# Altium schematic sheet MainSheet.SchDoc
size A4; SheetNumber: 1; SheetTotal: 7
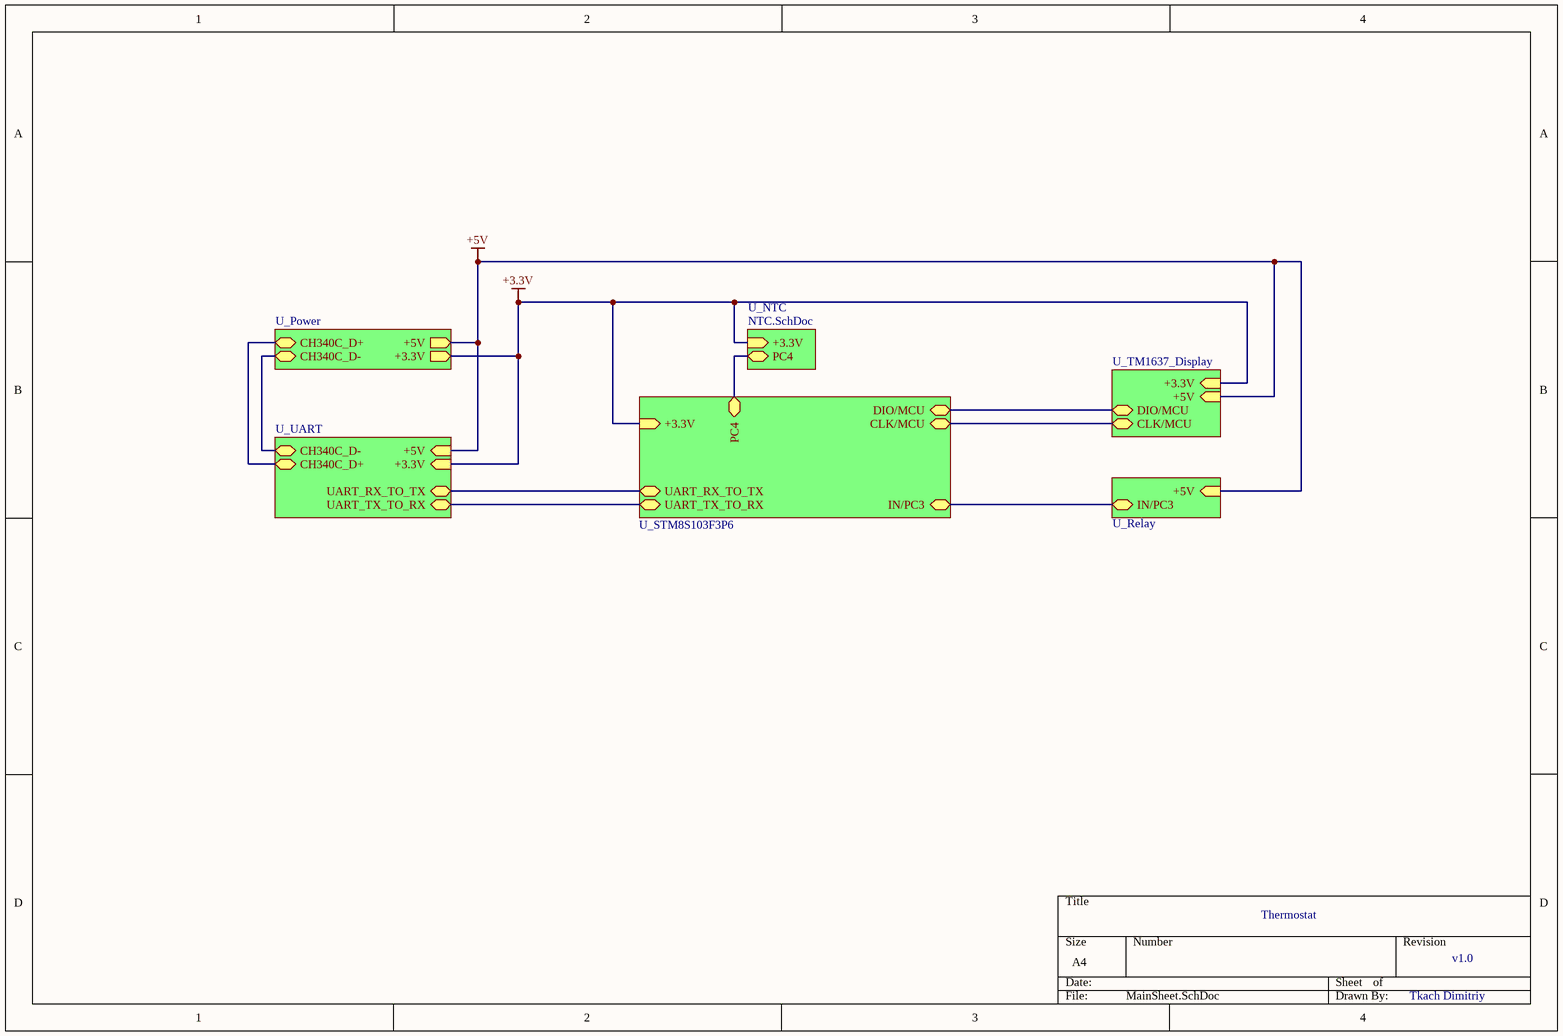
[diagram p0: MainSheet.SchDoc]

## Sub-sheets
U_NTC = NTC.SchDoc: PC4 (bidir), +3.3V (in)
U_Power = Power.SchDoc: CH340C_D+ (bidir), CH340C_D- (bidir), +5V (out), +3.3V (out)
U_Relay = Relay.SchDoc: IN/PC3 (bidir), +5V (in)
U_STM8S103F3P6 = STM8S103F3P6.SchDoc: +3.3V (in), IN/PC3 (bidir), DIO/MCU (bidir), CLK/MCU (bidir), UART_RX_TO_TX (bidir), UART_TX_TO_RX (bidir), PC4 (bidir)
U_TM1637_Display = TM1637_Display.SchDoc: +5V (in), +3.3V (in), DIO/MCU (bidir), CLK/MCU (bidir)
U_UART = UART.SchDoc: +5V (in), CH340C_D+ (bidir), CH340C_D- (bidir), UART_RX_TO_TX (bidir), +3.3V (in), UART_TX_TO_RX (bidir)

## Nets
+3.3V: sheet U_Power/+3.3V, sheet U_TM1637_Display/+3.3V, sheet U_UART/+3.3V, sheet U_STM8S103F3P6/+3.3V, sheet U_NTC/+3.3V
+5V: sheet U_Power/+5V, sheet U_Relay/+5V, sheet U_TM1637_Display/+5V, sheet U_UART/+5V
(unnamed): sheet U_Power/CH340C_D+, sheet U_UART/CH340C_D+
(unnamed): sheet U_Power/CH340C_D-, sheet U_UART/CH340C_D-
(unnamed): sheet U_Relay/IN/PC3, sheet U_STM8S103F3P6/IN/PC3
(unnamed): sheet U_TM1637_Display/DIO/MCU, sheet U_STM8S103F3P6/DIO/MCU
(unnamed): sheet U_TM1637_Display/CLK/MCU, sheet U_STM8S103F3P6/CLK/MCU
(unnamed): sheet U_UART/UART_RX_TO_TX, sheet U_STM8S103F3P6/UART_RX_TO_TX
(unnamed): sheet U_UART/UART_TX_TO_RX, sheet U_STM8S103F3P6/UART_TX_TO_RX
(unnamed): sheet U_STM8S103F3P6/PC4, sheet U_NTC/PC4

## Notes on the sheet
- Thermostat
- v1.0
- Tkach Dimitriy